# EAGLE design Module I2C Amiga Floppy (EAGLE 7.5.0)
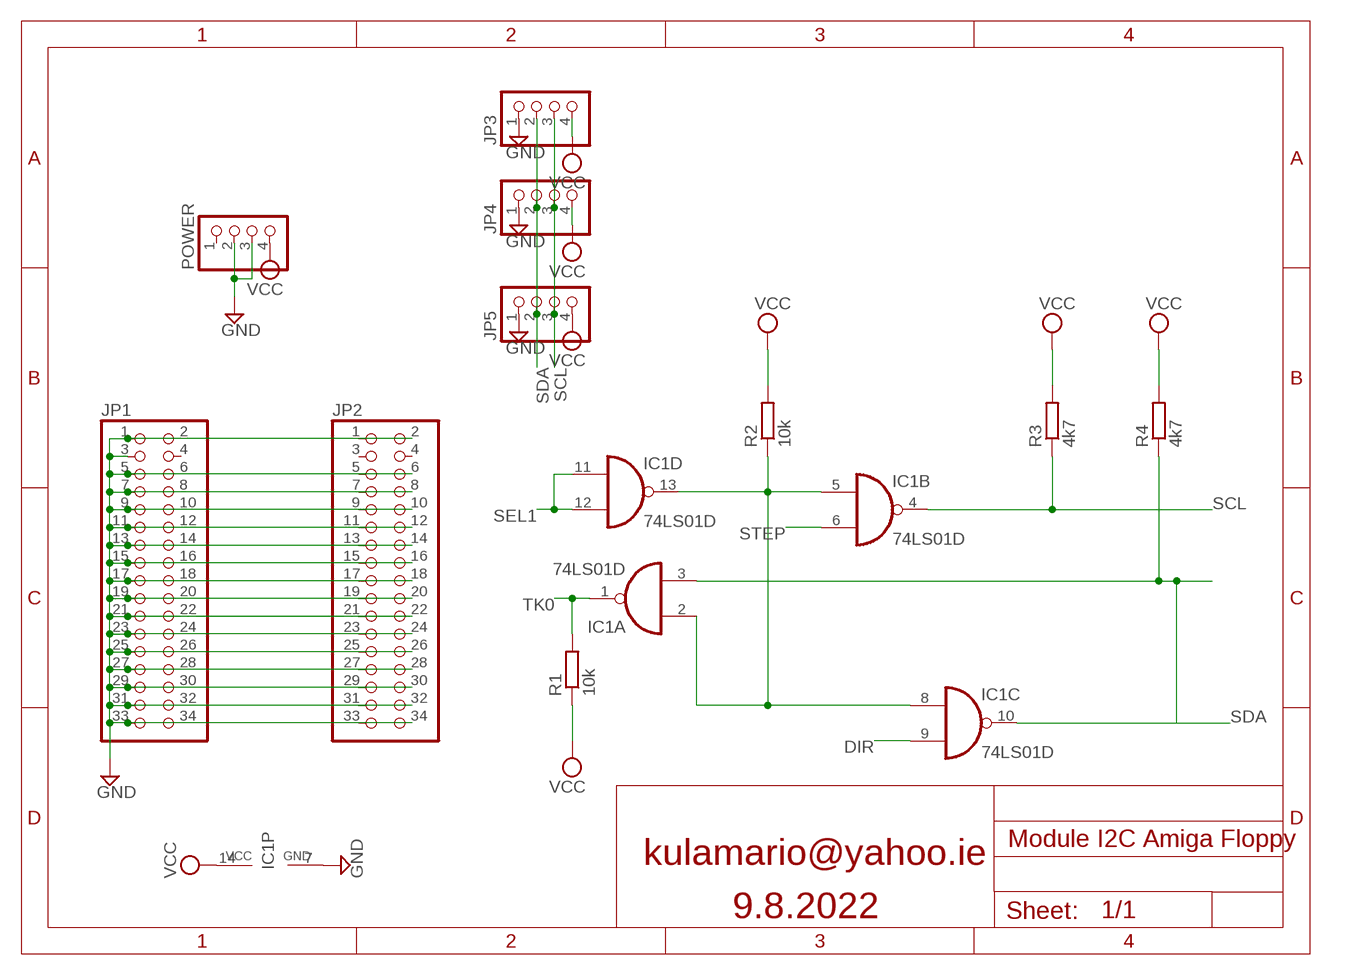
[diagram p0: schematic, sheet 1]

## Parts
IC1  74LS01D  [SO14]
JP1  PINHD-2X17  [2X17]
JP2  PINHD-2X17  [2X17]
JP3  PINHD-1X4  [1X04]
JP4  PINHD-1X4  [1X04]
JP5  PINHD-1X4  [1X04]
POWER  PINHD-1X4  [1X04]
R1  10k  R-EU_R0805  [R0805]
R2  10k  R-EU_R0805  [R0805]
R3  4k7  R-EU_R0805  [R0805]
R4  4k7  R-EU_R0805  [R0805]

## Nets
DIR: IC1.9(C:I1) JP1.18 JP2.18
GND: IC1.7(P:GND) JP1.1 JP1.3 JP1.5 JP1.7 JP1.9 JP1.11 JP1.13 JP1.15 JP1.17 JP1.19 JP1.21 JP1.23 JP1.25 JP1.27 JP1.29 JP1.31 JP1.33 JP2.1 JP2.5 JP2.7 JP2.9 JP2.11 JP2.13 JP2.15 JP2.17 JP2.19 JP2.21 JP2.23 JP2.25 JP2.27 JP2.29 JP2.31 JP2.33 JP3.1 JP4.1 JP5.1 POWER.2 POWER.3
N$1: IC1.2(A:I0) IC1.5(B:I0) IC1.8(C:I0) IC1.13(D:O) R2.1
N$2: JP1.2 JP2.2
N$6: JP1.6 JP2.6
N$8: JP1.8 JP2.8
N$10: JP1.10 JP2.10
N$14: JP1.14 JP2.14
N$16: JP1.16 JP2.16
N$22: JP1.22 JP2.22
N$24: JP1.24 JP2.24
N$28: JP1.28 JP2.28
N$30: JP1.30 JP2.30
N$32: JP1.32 JP2.32
N$34: JP1.34 JP2.34
SCL: IC1.4(B:O) JP3.3 JP4.3 JP5.3 R3.1
SDA: IC1.3(A:I1) IC1.10(C:O) JP3.2 JP4.2 JP5.2 R4.1
SEL1: IC1.11(D:I0) IC1.12(D:I1) JP1.12 JP2.12
STEP: IC1.6(B:I1) JP1.20 JP2.20
TK0: IC1.1(A:O) JP1.26 JP2.26 R1.2
VCC: IC1.14(P:VCC) JP3.4 JP4.4 JP5.4 POWER.4 R1.1 R2.2 R3.2 R4.2
Unconnected: JP1.4 JP2.3 JP2.4 POWER.1

## Notes on the sheet
- kulamario@yahoo.ie
- 9.8.2022

## Library data of the parts
IC1 = 74xx-eu:74*01: Quad 2-input NAND gate, open collector
JP1 JP2 = pinhead:PINHD-2X17: PIN HEADER
JP3-JP5 POWER = pinhead:PINHD-1X4: PIN HEADER
R1-R4 = rcl:R-EU_: RESISTOR, European symbol

## Board
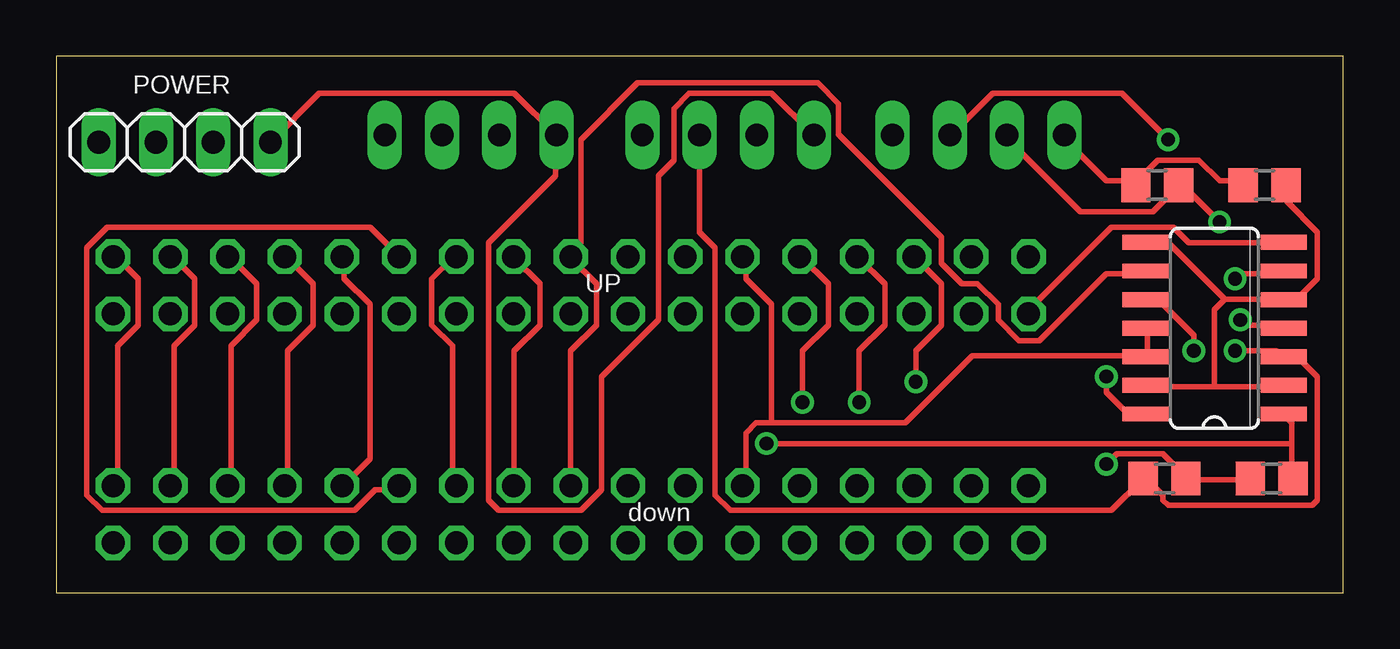
[diagram p1: board, top side]
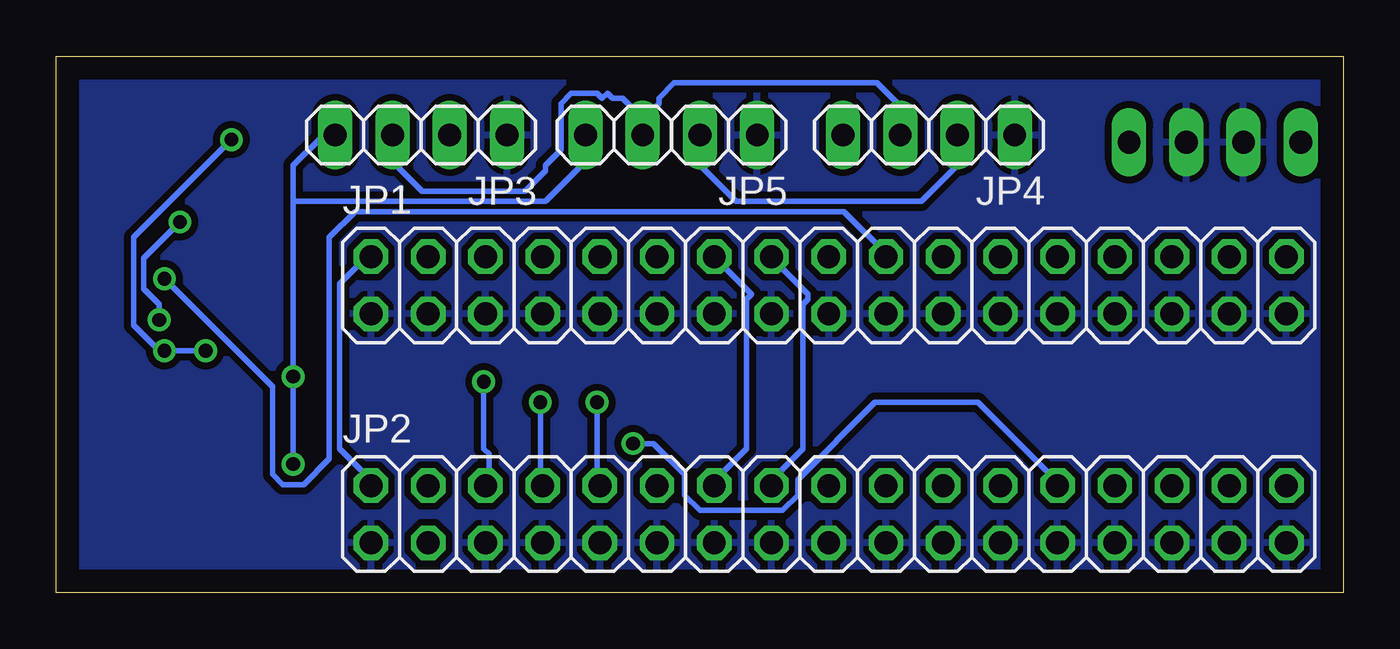
[diagram p2: board, bottom side, seen from below]

Size 57.13 x 23.8 mm. Coordinates in mm from the lower left corner, seen from the top.
Outline: 57.13,23.8 0,23.8 0,0 57.13,0 57.13,23.8
Copper layers (1*16): Top 0.035mm / dielectric 1.5mm / Bottom 0.035mm
Design rules "default": minimum track width 10mil, minimum drill 24mil, track to track 8mil, track to pad 8mil, pad to pad 8mil, via to via 8mil, smd to smd 8mil, copper to edge 40mil, drill to drill 8mil, minimum pad ring 10mil, minimum via ring 8mil, stop-mask expansion 4mil, vias tented up to drill 0mil, thermal gap 10mil

### Footprints (pad centres in the part's own frame; a part is rotated, then mirrored left to right if it is on the bottom)
SO14 = smd 0.66 x 2.032: 1 -3.81,-3.073; 2 -2.54,-3.073; 3 -1.27,-3.073; 4 0,-3.073; 5 1.27,-3.073; 6 2.54,-3.073; 7 3.81,-3.073; 8 3.81,3.073; 9 2.54,3.073; 10 1.27,3.073; 11 0,3.073; 12 -1.27,3.073; 13 -2.54,3.073; 14 -3.81,3.073
2X17 = drill 1.016 octagon: 1 -20.32,-1.27; 2 -20.32,1.27; 3 -17.78,-1.27; 4 -17.78,1.27; 5 -15.24,-1.27; 6 -15.24,1.27; 7 -12.7,-1.27; 8 -12.7,1.27; 9 -10.16,-1.27; 10 -10.16,1.27; 11 -7.62,-1.27; 12 -7.62,1.27; 13 -5.08,-1.27; 14 -5.08,1.27; 15 -2.54,-1.27; 16 -2.54,1.27; 17 0,-1.27; 18 0,1.27; 19 2.54,-1.27; 20 2.54,1.27; 21 5.08,-1.27; 22 5.08,1.27; 23 7.62,-1.27; 24 7.62,1.27; 25 10.16,-1.27; 26 10.16,1.27; 27 12.7,-1.27; 28 12.7,1.27; 29 15.24,-1.27; 30 15.24,1.27; 31 17.78,-1.27; 32 17.78,1.27; 33 20.32,-1.27; 34 20.32,1.27
1X04 = drill 1.016 long: 1 -3.81,0; 2 -1.27,0; 3 1.27,0; 4 3.81,0
R0805 = smd 1.3 x 1.5: 1 -0.95,0; 2 0.95,0

### Placement (x,y rotation side)
IC1  51.41,11.74 90 top
JP1  22.84,13.64 0 bottom
JP2  22.84,3.48 0 bottom
JP3  40.94,20.31 180 bottom
JP4  18.39,20.31 180 bottom
JP5  29.82,20.31 180 bottom
POWER  5.7,19.99 0 top
R1  53.95,5.07 0 top
R2  53.64,18.09 180 top
R3  48.88,18.09 180 top
R4  49.19,5.07 0 top

### Tracks (layer width: path | path; a pad name or v marks a point on that pad's centre or on a via)
DIR
  Top 0.254: IC1.9 48.21,14.16 46.61,14.16 43.64,11.19 42.73,11.19 41.81,12.1 41.81,12.79 40.9,13.7 40.21,13.7 39.3,14.62 39.3,15.76 34.73,20.33 34.73,21.7 33.81,22.62 25.81,22.62 23.3,20.1 23.3,15.53 22.84,15.08 JP1.18 22.84,14.85 23.98,13.7 23.98,11.87 22.84,10.73 JP2.18
GND
  Top 0.254: IC1.7 54.39,15.53 50.27,15.53 49.59,16.22 46.84,16.22 43.18,12.56 JP1.1
  pour Bottom (isolate 0.305): 57.13,-0.33 -0.02,-0.33 -0.02,23.8 57.13,23.8
N$1
  Top 0.254: 51.41,9.13 54.39,9.13 IC1.2 | 51.41,9.13 48.44,9.13 IC1.13 | R2.1 54.61,18.05 54.61,17.36 55.99,15.99 55.99,13.93 55.07,13.02 54.61,13.02 IC1.5 54.39,13.02 51.87,13.02 | 51.87,13.02 49.36,15.53 48.44,15.53 IC1.8 | 51.41,9.13 51.41,12.56 51.87,13.02
N$2
  Bottom 0.254: JP2.2 43.18,4.79 43.18,5.02 44.56,6.39 44.56,13.7 43.18,15.08 JP1.2
N$6  (via drill 0.61)
  Top 0.254: v38.16,9.36 38.16,10.73 39.3,11.87 39.3,13.7 38.16,14.85 JP1.6
  Bottom 0.254: v38.16,9.36 38.16,6.39 37.93,6.16 37.93,4.79 JP2.6
N$8  (via drill 0.61)
  Top 0.254: v35.64,8.45 35.64,10.73 36.78,11.87 36.78,13.7 35.64,14.85 JP1.8
  Bottom 0.254: v35.64,8.45 35.64,4.79 JP2.8
N$10  (via drill 0.61)
  Top 0.254: v33.13,8.45 33.13,10.73 34.27,11.87 34.27,13.7 33.13,14.85 JP1.10
  Bottom 0.254: v33.13,8.45 33.13,4.79 JP2.10
N$14
  Bottom 0.254: JP2.14 27.87,4.79 27.87,5.02 26.5,6.39 26.5,13.02 26.27,13.25 27.87,14.85 JP1.14
N$16
  Bottom 0.254: JP2.16 25.36,4.79 25.36,5.02 23.98,6.39 23.98,12.79 23.75,13.02 23.75,13.25 25.36,14.85 JP1.16
N$22
  Top 0.254: JP2.22 17.58,4.79 17.58,10.96 16.67,11.87 16.67,13.93 17.58,14.85 JP1.22
N$24
  Top 0.254: JP2.24 15.07,4.56 14.15,4.56 13.24,3.65 2.04,3.65 1.35,4.33 1.35,15.3 2.27,16.22 13.93,16.22 15.07,15.08 JP1.24
N$28
  Top 0.254: JP2.28 10.27,4.79 10.27,10.73 11.41,11.87 11.41,13.7 10.27,14.85 JP1.28
N$30
  Top 0.254: JP2.30 7.75,4.79 7.75,10.96 8.89,12.1 8.89,13.7 7.75,14.85 JP1.30
N$32
  Top 0.254: JP2.32 5.24,4.79 5.24,10.96 6.15,11.87 6.15,13.93 5.24,14.85 JP1.32
N$34
  Top 0.254: JP2.34 2.72,4.79 2.72,10.96 3.64,11.87 3.64,13.93 2.72,14.85 JP1.34
SCL  (via drill 0.61)
  Top 0.254: JP3.3 42.27,20.1 45.47,16.9 48.67,16.9 49.81,18.05 R3.1 50.04,18.05 v51.64,16.45 | v52.56,12.1 52.79,11.87 54.39,11.87 IC1.4
  Bottom 0.254: 31.07,21.02 30.38,21.7 30.38,21.93 29.7,22.62 20.71,22.62 19.66,21.58 JP4.3 | 31.07,21.02 31.07,20.33 JP5.3 31.07,21.02 | v52.56,12.1 52.56,12.79 53.24,13.47 53.24,14.85 v51.64,16.45 | 31.07,21.02 31.98,21.93 32.44,21.93 32.67,22.16 32.9,21.93 33.13,22.16 34.27,22.16 34.73,21.7 34.73,19.65 35.41,18.96 35.41,18.73 36.33,17.82 40.9,17.82 42.04,18.96 42.04,20.1 JP3.3
SDA  (via drill 0.61)
  Top 0.254: v50.5,10.73 50.5,11.42 49.13,12.79 48.44,12.79 IC1.10 | v52.33,10.73 54.16,10.73 54.39,10.5 IC1.3 54.61,10.27 55.3,10.27 55.99,9.59 55.99,4.1 55.76,3.87 49.36,3.87 49.13,4.1 49.13,4.33 48.44,5.02 R4.1 48.21,5.02 46.84,3.65 29.93,3.65 29.24,4.33 29.24,15.3 28.55,15.99 JP5.2 | v49.36,20.1 47.3,22.16 41.58,22.16 39.76,20.33 JP3.2
  Bottom 0.254: JP4.2 17.12,18.96 18.73,17.36 26.96,17.36 28.55,18.96 JP5.2 | v50.5,10.73 v52.33,10.73 52.56,10.73 53.7,11.87 53.7,15.76 v49.36,20.1
SEL1
  Top 0.254: IC1.11 48.44,11.65 48.44,10.5 IC1.12 48.21,10.5 40.67,10.5 37.7,7.53 31.75,7.53 | 31.75,7.53 31.07,7.53 30.61,7.07 30.61,4.79 JP2.12 | 31.75,7.53 31.75,12.79 30.61,13.93 30.61,14.85 JP1.12
STEP  (via drill 0.61)
  Top 0.254: v52.33,13.93 52.56,14.16 54.39,14.16 IC1.6 | JP2.20 20.32,4.79 20.32,10.73 21.47,11.87 21.47,13.7 20.32,14.85 JP1.20
  Bottom 0.254: v52.33,13.93 47.53,9.13 47.53,5.25 47.07,4.79 46.16,4.79 45.01,5.93 45.01,15.76 43.87,16.9 22.15,16.9 20.32,15.08 JP1.20
TK0  (via drill 0.61)
  Top 0.254: 54.84,6.62 54.84,7.53 54.61,7.76 IC1.1 | 54.84,6.62 54.84,5.25 R1.2 | v31.53,6.62 54.84,6.62 | JP1.26 12.78,14.85 12.78,13.93 13.93,12.79 13.93,5.93 12.78,4.79 JP2.26
  Bottom 0.254: v31.53,6.62 30.61,6.62 29.24,5.25 29.24,4.33 28.55,3.65 24.9,3.65 24.21,4.33 24.21,5.02 20.78,8.45 16.21,8.45 12.55,4.79 JP2.26
VCC  (via drill 0.61)
  Top 0.254: R1.1 52.79,5.02 50.27,5.02 R4.2 50.04,5.25 49.13,6.16 47.07,6.16 v46.61,5.7 | JP3.4 44.79,20.1 46.61,18.28 47.76,18.28 R3.2 47.99,18.28 48.9,19.19 50.73,19.19 51.64,18.28 52.56,18.28 R2.2 | v46.61,9.59 46.61,8.9 47.53,7.99 48.21,7.99 IC1.14 | JP5.4 33.58,20.33 31.75,22.16 28.1,22.16 27.41,21.48 27.41,19.19 26.73,18.5 26.73,12.1 24.21,9.59 24.21,4.56 23.3,3.65 19.64,3.65 19.18,4.1 19.18,15.53 22.15,18.5 22.15,20.1 JP4.4 22.15,20.33 20.32,22.16 11.68,22.16 POWER.4
  Bottom 0.254: 46.61,17.36 46.61,18.96 45.47,20.1 44.79,20.1 JP3.4 | 46.61,17.36 v46.61,9.59 v46.61,5.7 | 46.61,17.36 35.41,17.36 33.81,18.96 33.81,20.1 JP5.4

### Text on the board
tNames: UP | down